# Altium schematic sheet Power.SchDoc
size Letter; SheetNumber: 1; SheetTotal: 3
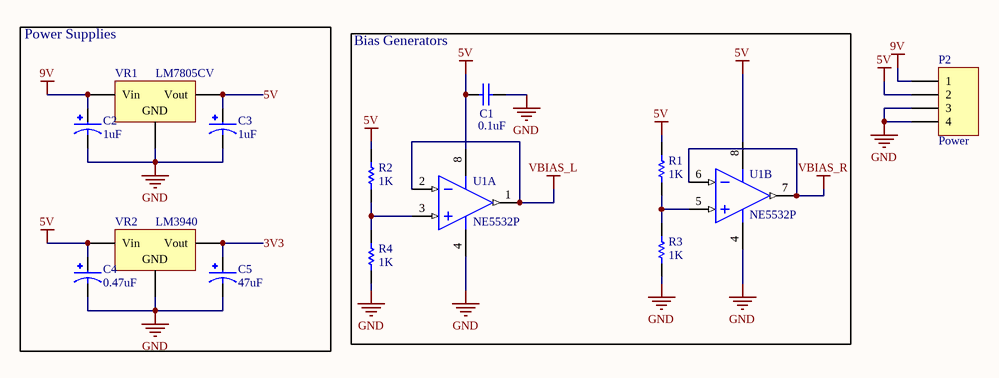
[diagram p0: Power.SchDoc]

## Parts
C1  value 0.1uF  [RAD-0.1]  (hidden comment: Cap)
C2  1uF  [CAPPRD200W50D500H1500]
C3  1uF  [CAPPRD200W50D500H1500]
C4  0.47uF  [CAPPRD200W50D500H1500]
C5  47uF  [CAPPRD200W50D500H1500]
P2  Power  [HDR1X4]
R1  value 1K  [AXIAL-0.3]  (hidden comment: Res1)
R2  value 1K  [AXIAL-0.3]  (hidden comment: Res1)
R3  value 1K  [AXIAL-0.3]  (hidden comment: Res1)
R4  value 1K  [AXIAL-0.3]  (hidden comment: Res1)
U1  NE5532P  [TI-P8]  (parts A,B of 2)
VR1  LM7805CV  [T03B]
VR2  LM3940  [T03B]

## Blocks framed on the sheet
Power Supplies: C2-C5 VR1 VR2
Bias Generators: C1 R1-R4 U1

## Nets
5V: C1.1 C3.P C4.P P2.2 R1.2 R2.2 U1.8(VCC+) VR1.3(Vout) VR2.1(Vin)
9V: C2.P P2.1 VR1.1(Vin)
GND: C1.2 C2.N C3.N C4.N C5.N P2.3 P2.4 R3.1 R4.1 U1.4(VCC-) VR1.2(GND) VR2.2(GND)
VBIAS_L: U1.1(OUT1) U1.2(IN1-)
VBIAS_R: U1.6(IN2-) U1.7(OUT2)
3V3: C5.P VR2.3(Vout)
NetR1_1: R1.1 R3.2 U1.5(IN2+)
NetR2_1: R2.1 R4.2 U1.3(IN1+)

## Library data of the parts
C1 = Cap: Capacitor; Published: 8-Jun-2000; LatestRevisionDate: 17-Jul-2002; LatestRevisionNote: Re-released for DXP Platform.; PackageReference: RAD-0.3; Publisher: Altium Limited; PackageDescription: Radial Cap, Thru-Hole; 2 Leads; 0.3 in Pin Spacing
C2-C5 = EEUEB1J1R0: 1F 63V Aluminum Electrolytic Capacitors Radial, Can 5000 Hrs @ 105C; MP: EEU-EB1J1R0; MF: Panasonic Electronic Components; Price: None; Value: *; Package: RADIAL-2 Panasonic; Check_prices: https://www.snapeda.com/parts/EEU-EB1J1R0/Panasonic/view-part/6221748/?ref=eda; SnapEDA_Link: https://www.snapeda.com/parts/EEU-EB1J1R0/Panasonic/view-part/6221748/?ref=snap; Availability: Not in stock
P2 = Header 4: Header, 4-Pin; LatestRevisionDate: 17-Jul-2002; LatestRevisionNote: Re-released for DXP Platform.; Publisher: Altium Limited
R1-R4 = Res1: Resistor; Published: 8-Jun-2000; LatestRevisionDate: 17-Jul-2002; LatestRevisionNote: Re-released for DXP Platform.; PackageReference: AXIAL-0.3; Publisher: Altium Limited; PackageDescription: Axial Device, Thru-Hole; 2 Leads; 0.3 in Pin Spacing
U1 = NE5532P: Dual Low-Noise High-Speed Audio Operational Amplifier, 10 to 30 V, 0 to 70 degC, 8-pin DIP (P8), Pb-Free (RoHS); Manufacturer: Texas Instruments; Slew Rate(Typ)(V/us): 9; CMRR(Min)(dB): 70; Sub Family: General Purpose Amplifier, High Supply Voltage Amplifier (>=30V), Low Noise Amp (<=10nV/rtHz); IIB(Max)(pA): 800000; GBW(Typ)(MHz): 10; Iq per channel(Max)(mA): 4; Number of Channels: 2; Vn at 1kHz(Typ)(nV/rtHz): 5; Total Supply Voltage(Max)(+5V is 5, +/-5V is 10): 30; Eco-Plan: Pb-Free (RoHS); PartNumber: NE5532P; ComponentLink1Description: Manufacturer URL; ComponentLink2Description: Datasheet; DatasheetVersion: SLOS075I; ComponentLink3URL: http://www.ti.com/litv/pdf/mpdi001b; ComponentLink1URL: http://www.ti.com/; Code_JEDEC: MS-001; Total Supply Voltage(Min)(+5V is 5, +/-5V is 10): 10; ComponentLink2URL: http://www.ti.com/lit/ds/symlink/ne5532.pdf; PackageReference: P8; ComponentLink3Description: Package Specification; Vio (25C)(Max)(mV): 4; PackageVersion: 4040082/E, 04/2010; Mounting Technology: Through Hole; PackageDescription: 8-Pin Plastic In-Line, Body 9.59 x 6.35 mm, Pitch 2.54 mm
VR1 VR2 = Volt Reg: Voltage Regulator; Published: 24-Mar-1999; LatestRevisionDate: 29-May-2009; LatestRevisionNote: IPC-7351 Footprint Added.; PackageReference: D2PAK; Publisher: Altium Limited; PackageDescription: 3-Pin Transistor Outline Package 2.54 mm Pitch, 15.1 mm Lead Span